# Altium schematic sheet PCIe_USB30_Conn_Internal_Vertical.SchDoc
size A
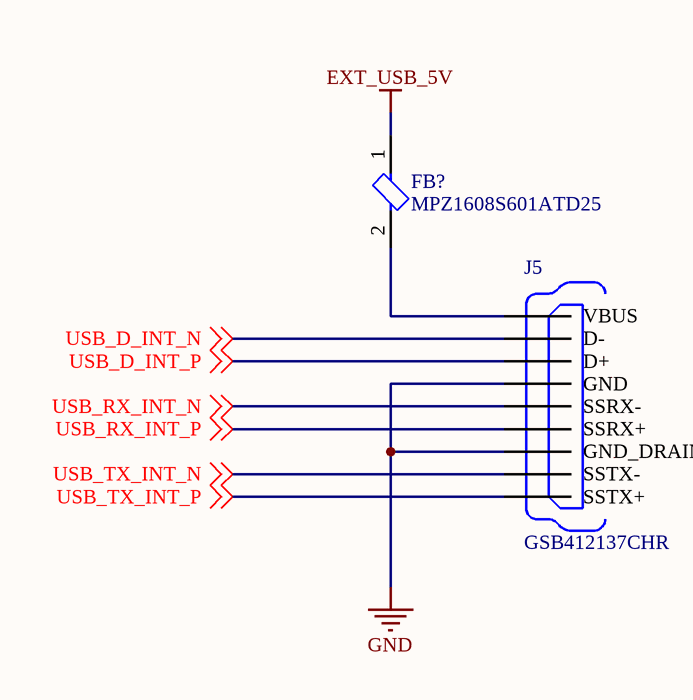
[diagram p0: PCIe_USB30_Conn_Internal_Vertical.SchDoc]

## Parts
FB?  MPZ1608S601ATD25  [FP-MPZ1608-0_8-IPC_B]
J5  GSB412137CHR  [AMPHENOL_GSB412137CHR]

## Nets
EXT_USB_5V: FB?.1
GND: J5.4(GND) J5.7(GND_DRAIN)
USB_D_INT_N: J5.2(D-) ; off-sheet USB_D_INT_N
USB_D_INT_P: J5.3(D+) ; off-sheet USB_D_INT_P
USB_RX_INT_N: J5.5(SSRX-) ; off-sheet USB_RX_INT_N
USB_RX_INT_P: J5.6(SSRX+) ; off-sheet USB_RX_INT_P
USB_TX_INT_N: J5.8(SSTX-) ; off-sheet USB_TX_INT_N
USB_TX_INT_P: J5.9(SSTX+) ; off-sheet USB_TX_INT_P
NetFB?_2: FB?.2 J5.1(VBUS)

## Library data of the parts
FB? = CMP-08257-000403-1: Power line Ferrite Bead 600Ω @ 100MHz 1A DCR 0.15Ω AEC-Q200 SMD 0603; Number of Lines: 1; DC Resistance (DCR): 150mR; Impedance: 600R; Tolerance: 25%; Length: 0.063inch; Max Operating Temperature: 125°C; Lead Free: Lead Free; Min Operating Temperature: -55°C; Test Frequency: 100MHz; Termination: SMD/SMT; Packaging: Tape and Reel; Package Quantity: 4000; Case Code (Metric): 1608; Series: MPZ; Max Current Rating: 1A; Mount: Surface Mount; Max DC Current: 1A; RoHS Compliant: Yes; Case/Package: 0603; Weight: 7.1E-05oz; Ratings: AEC-Q200; Height: 0.037inch; Width: 0.031inch; Case Code (Imperial): 0603
J5 = GSB412137CHR: USB-A _USB TYPE-A_ USB 3.1 _USB 3.1 Gen 2, Superspeed+_ Receptacle Connector 9 Position Through Hole; MF: Amphenol ICC; MP: GSB412137CHR; Digi-Key_Part_Number: GSB412137CHR-ND; Package: None; Digi-Key_Purchase_URL: https://www.digikey.com/product-detail/en/amphenol-icc-commercial-products/GSB412137CHR/GSB412137CHR-ND/4883784?utm_source=snapeda&utm_medium=aggregator&utm_campaign=symbol; Value: *; SnapEDA_Link: https://www.snapeda.com/parts/GSB412137CHR/Amphenol%20FCI/view-part/480805/?ref=snap